# Altium schematic sheet SAM_E54_Xplained_Pro_current_measurement_control.SchDoc: Current measurement control
size A3; Organization: Microchip Norway; Address1: Vestre Rosten 79; Address2: N-7075 TILLER; Address3: NORWAY; DocumentNumber: A09-2748; Revision: 5; SheetNumber: 12; SheetTotal: 13; DrawnBy: Microchip Norway; Engineer: HN; PageSetup: Record=PageOptions|CenterHorizontal=True|CenterVertical=True|PrintScale=1.01|XCorrection=1.00|YCorrection=1.00|PrintKind=1|BorderSize=5000000|LeftOffset=0|BottomOffset=0|Orientation=2|PaperLength=1000|PaperWidth=1000|Scale=100|PaperSource=7|PrintQuality=-4|MediaType=1|DitherType=10|PaperKind=A3 (297 x 420 mm)|PrintScaleMode=1; ProjectTitle: SAM E54 Xplained Pro; PCBNumber: A08-2643; PCBRevision: 3; ProjectName: SAM E54 Xplained Pro
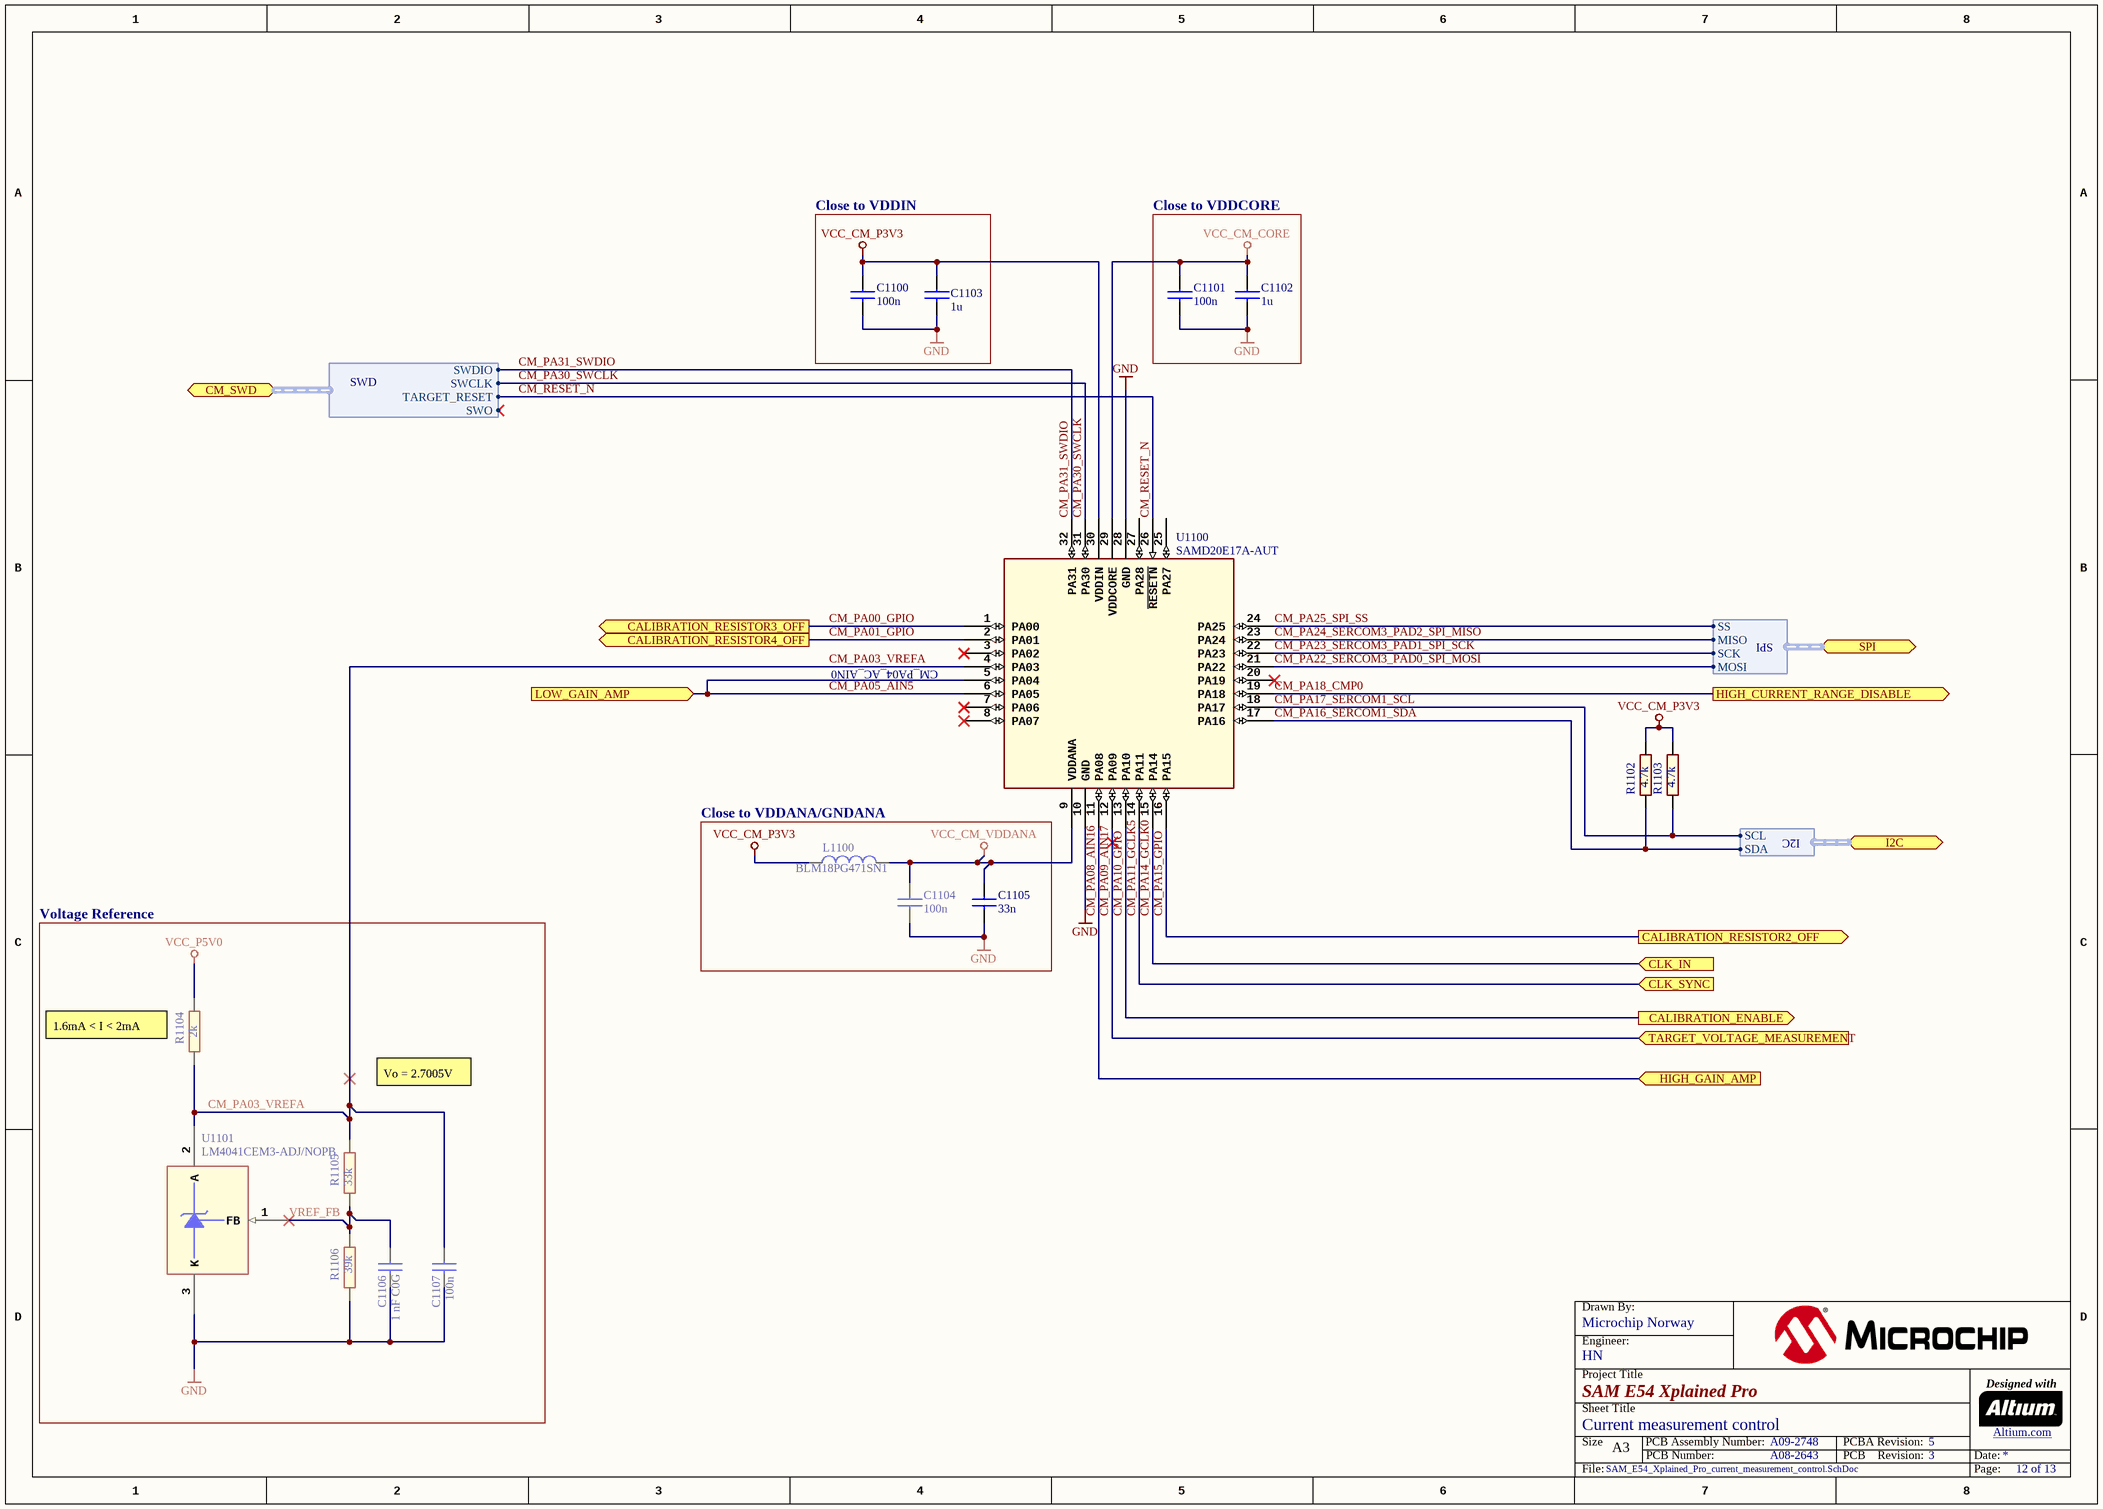
[diagram p0: SAM_E54_Xplained_Pro_current_measurement_control.SchDoc]

## Parts
C1100  value 100n  [AP1-00053]
C1101  value 100n  [AP1-00053]
C1102  value 1u  [AP1-00053]
C1103  value 1u  [AP1-00053]
C1104  value 100n  [AP1-00053]
C1105  value 33n  [AP1-00053]
C1106  value 1 nF C0G  [AP1-00053]
C1107  value 100n  [AP1-00053]
L1100  value BLM18PG471SN1  [AP3-00005]
R1102  value 4.7k  [AP2-00011]
R1103  value 4.7k  [AP2-00011]
R1104  value 2k  [AP2-00011]
R1105  value 33k  [AP2-00011]
R1106  value 39k  [AP2-00011]
U1100  value SAMD20E17A-AUT  [AP6-00061]
U1101  value LM4041CEM3-ADJ/NOPB  [AP5-00002]

## Blocks framed on the sheet
Close to VDDIN: C1100 C1103
Close to VDDCORE: C1101 C1102
Close to VDDANA/GNDANA: C1104 C1105 L1100
Voltage Reference: C1106 C1107 R1104-R1106 U1101

## Ports
CALIBRATION_ENABLE (out), CALIBRATION_RESISTOR2_OFF (out), CALIBRATION_RESISTOR3_OFF (out), CALIBRATION_RESISTOR4_OFF (out), CLK_IN (in), CLK_SYNC (in), CM_SWD (harness SWD), HIGH_CURRENT_RANGE_DISABLE (out), HIGH_GAIN_AMP (in), I2C (harness I2C), LOW_GAIN_AMP (in), SPI (harness SPI), TARGET_VOLTAGE_MEASUREMENT (in)

## Harnesses
SPI: MISO, MOSI, SCK, SS
I2C: SCL, SDA
SWD: SWCLK, SWDIO, TARGET_RESET, SWO

## Nets
GND: C1100.2 C1101.2 C1102.2 C1103.2 C1104.2 C1105.2 C1106.2 C1107.2 R1106.1 U1100.10(GND) U1100.28(GND) U1101.3(K)
VCC_CM_CORE: C1101.1 C1102.1 U1100.29(VDDCORE)
VCC_CM_P3V3: C1100.1 C1103.1 L1100.1 R1102.2 R1103.2 U1100.30(VDDIN)
VCC_CM_VDDANA: C1104.1 C1105.1 L1100.2 U1100.9(VDDANA)
VCC_P5V0: R1104.2
CM_PA00_GPIO: U1100.1(PA00) ; port CALIBRATION_RESISTOR3_OFF
CM_PA01_GPIO: U1100.2(PA01) ; port CALIBRATION_RESISTOR4_OFF
CM_PA03_VREFA: C1107.1 R1104.1 R1105.2 U1100.4(PA03) U1101.2(A)
CM_PA05_AIN5: U1100.5(PA04) U1100.6(PA05) ; port LOW_GAIN_AMP
CM_PA08_AIN16: U1100.11(PA08) ; port HIGH_GAIN_AMP
CM_PA09_AIN17: U1100.12(PA09) ; port TARGET_VOLTAGE_MEASUREMENT
CM_PA10_GPIO: U1100.13(PA10) ; port CALIBRATION_ENABLE
CM_PA11_GCLK5: U1100.14(PA11) ; port CLK_SYNC
CM_PA14_GCLK0: U1100.15(PA14) ; port CLK_IN
CM_PA15_GPIO: U1100.16(PA15) ; port CALIBRATION_RESISTOR2_OFF
CM_PA16_SERCOM1_SDA: R1102.1 U1100.17(PA16) ; port I2C.SDA
CM_PA17_SERCOM1_SCL: R1103.1 U1100.18(PA17) ; port I2C.SCL
CM_PA18_CMP0: U1100.19(PA18) ; port HIGH_CURRENT_RANGE_DISABLE
CM_PA22_SERCOM3_PAD0_SPI_MOSI: U1100.21(PA22) ; port SPI.MOSI
CM_PA23_SERCOM3_PAD1_SPI_SCK: U1100.22(PA23) ; port SPI.SCK
CM_PA24_SERCOM3_PAD2_SPI_MISO: U1100.23(PA24) ; port SPI.MISO
CM_PA25_SPI_SS: U1100.24(PA25) ; port SPI.SS
CM_PA30_SWCLK: U1100.31(PA30) ; port CM_SWD.SWCLK
CM_PA31_SWDIO: U1100.32(PA31) ; port CM_SWD.SWDIO
CM_RESET_N: U1100.26(~{RESETN}) ; port CM_SWD.TARGET_RESET
VREF_FB: C1106.1 R1105.1 R1106.2 U1101.1(FB)

Not connected (* = marked no-connect by the designer): U1100 3(PA02)* 7(PA06)* 8(PA07)* 20(PA19)* 25(PA27) 27(PA28)

## Notes on the sheet
- CM_PA04_AC_AIN0
- (near R1104) 1.6mA < I < 2mA
- Vo = 2.7005V
- Drawn By:
- Project Title
- Engineer:
- Designed with
- Sheet Title
- Size
- A3
- PCB Number:
- PCB Assembly Number:
- PCBA Revision:
- PCB    Revision:
- Date:
- Altium.com <http://go.altium.com/MicrochipLandingPage_Evaluation.html>
- File:
- Page:

## Library data of the parts
C1100 C1101 C1104 C1107 = A01-0246: Ceramic capacitor, SMD 0402, X7R, 16V, +/-10%; PartGroup: Capacitors,Ceramic,SMD 0402; Manufacturer: Kemet; MPN: C0402C104K4RACTU; TemperatureRange: -55 - +125 deg C; AN: A01-0246; Tolerance: 16V, +/-10%; Height: 0,5
C1102 C1103 = A01-0286: Ceramic capacitor, SMD 0402, X5R, 6.3V, +/-10% (de26942); PartGroup: Capacitors,Ceramic,SMD 0402; Manufacturer: Kemet; MPN: C0402C105K9PAC; TemperatureRange: -55 to 85 deg C; AN: A01-0286; Tolerance: +/-10%; Height: 0,5
C1105 = A01-0397: Ceramic capacitor, SMD 0402, X7R, 25V, ±10%; PartGroup: Capacitors,Ceramic,SMD 0402; Manufacturer: Murata; MPN: GRM155R71E333KA88D; Tolerance: ±10%(K); TemperatureRange: -55 to 125°C; AN: A01-0397; Height: 0,5
C1106 = A01-0321: Ceramic capacitor, SMD 0402, C0G, 50V, +/-5%; PartGroup: Capacitors,Ceramic,SMD 0402; Manufacturer: Murata; MPN: GRM1555C1H102JA01D; Tolerance: 5%; AN: A01-0321; Height: 0,550000011920929
L1100 = A03-0035: SMD RF inductor 0603. Z=470Ohm (@100MHz), Max R(dc)=0.65Ohm, Max current=1A; PartGroup: Inductors,EMI; Manufacturer: Murata; TemperatureRange: -55; AN: A03-0035; Height: 0,800000011920929; MPN: BLM18PG471SN1
R1102 R1103 = A02-0228: Thick film resistor, SMD 0402, 1/16W, 1%; PartGroup: Resistors,SMD,0402 1%; Manufacturer: PHYCOMP; MPN: 2322 706 74702L; TemperatureRange: -55ï¿½ to +125ï¿½C; AN: A02-0228; Tolerance: 1 %; Height: 0,349999994039536
R1104 = A02-0219: Thick film resistor, SMD 0402, 1/16W, 1%; PartGroup: Resistors,SMD,0402 1%; TemperatureRange: -55 - +125 deg C; AN: A02-0219; Tolerance: 1 %; Height: 0,349999994039536
R1105 = A02-0248: Thick film resistor, SMD 0402, 1/16W, 1%; PartGroup: Resistors,SMD,0402 1%; Manufacturer: ASJ; MPN: CR10-3302-FK; TemperatureRange: -55 - +125 deg C; AN: A02-0248; Tolerance: 1 %; Height: 0,349999994039536
R1106 = A02-0250: Thick film resistor, SMD 0402, 1/16W, 1%; PartGroup: Resistors,SMD,0402 1%; Manufacturer: ASJ; MPN: CR10-3902-FK; TemperatureRange: -55 - +125 deg C; AN: A02-0250; Tolerance: 1 %; Height: 0,349999994039536
U1100 = A06-1023: Atmel 32bit RISC MCU 32 pin; PartGroup: Integrated Circuits,MCU, MPU, DSP,ARM MCU; MPN: ATSAMD20E17A-AUT; Design comment: *; AN: A06-1023; Height: 1,20000004768372; Manufacturer: ATMEL
U1101 = A06-0123: Adjustable shunt voltage regulator, 1.24 to 10V out; PartGroup: Integrated Circuits,Regulators,Voltage reference; Manufacturer: Texas Instruments; TemperatureRange: -40 to +85 deg. C; AN: A06-0123; Height: 1; MPN: LM4041CEM3-ADJ/NOPB